# EAGLE design basic-thermometer.TH (EAGLE 7.1.0)
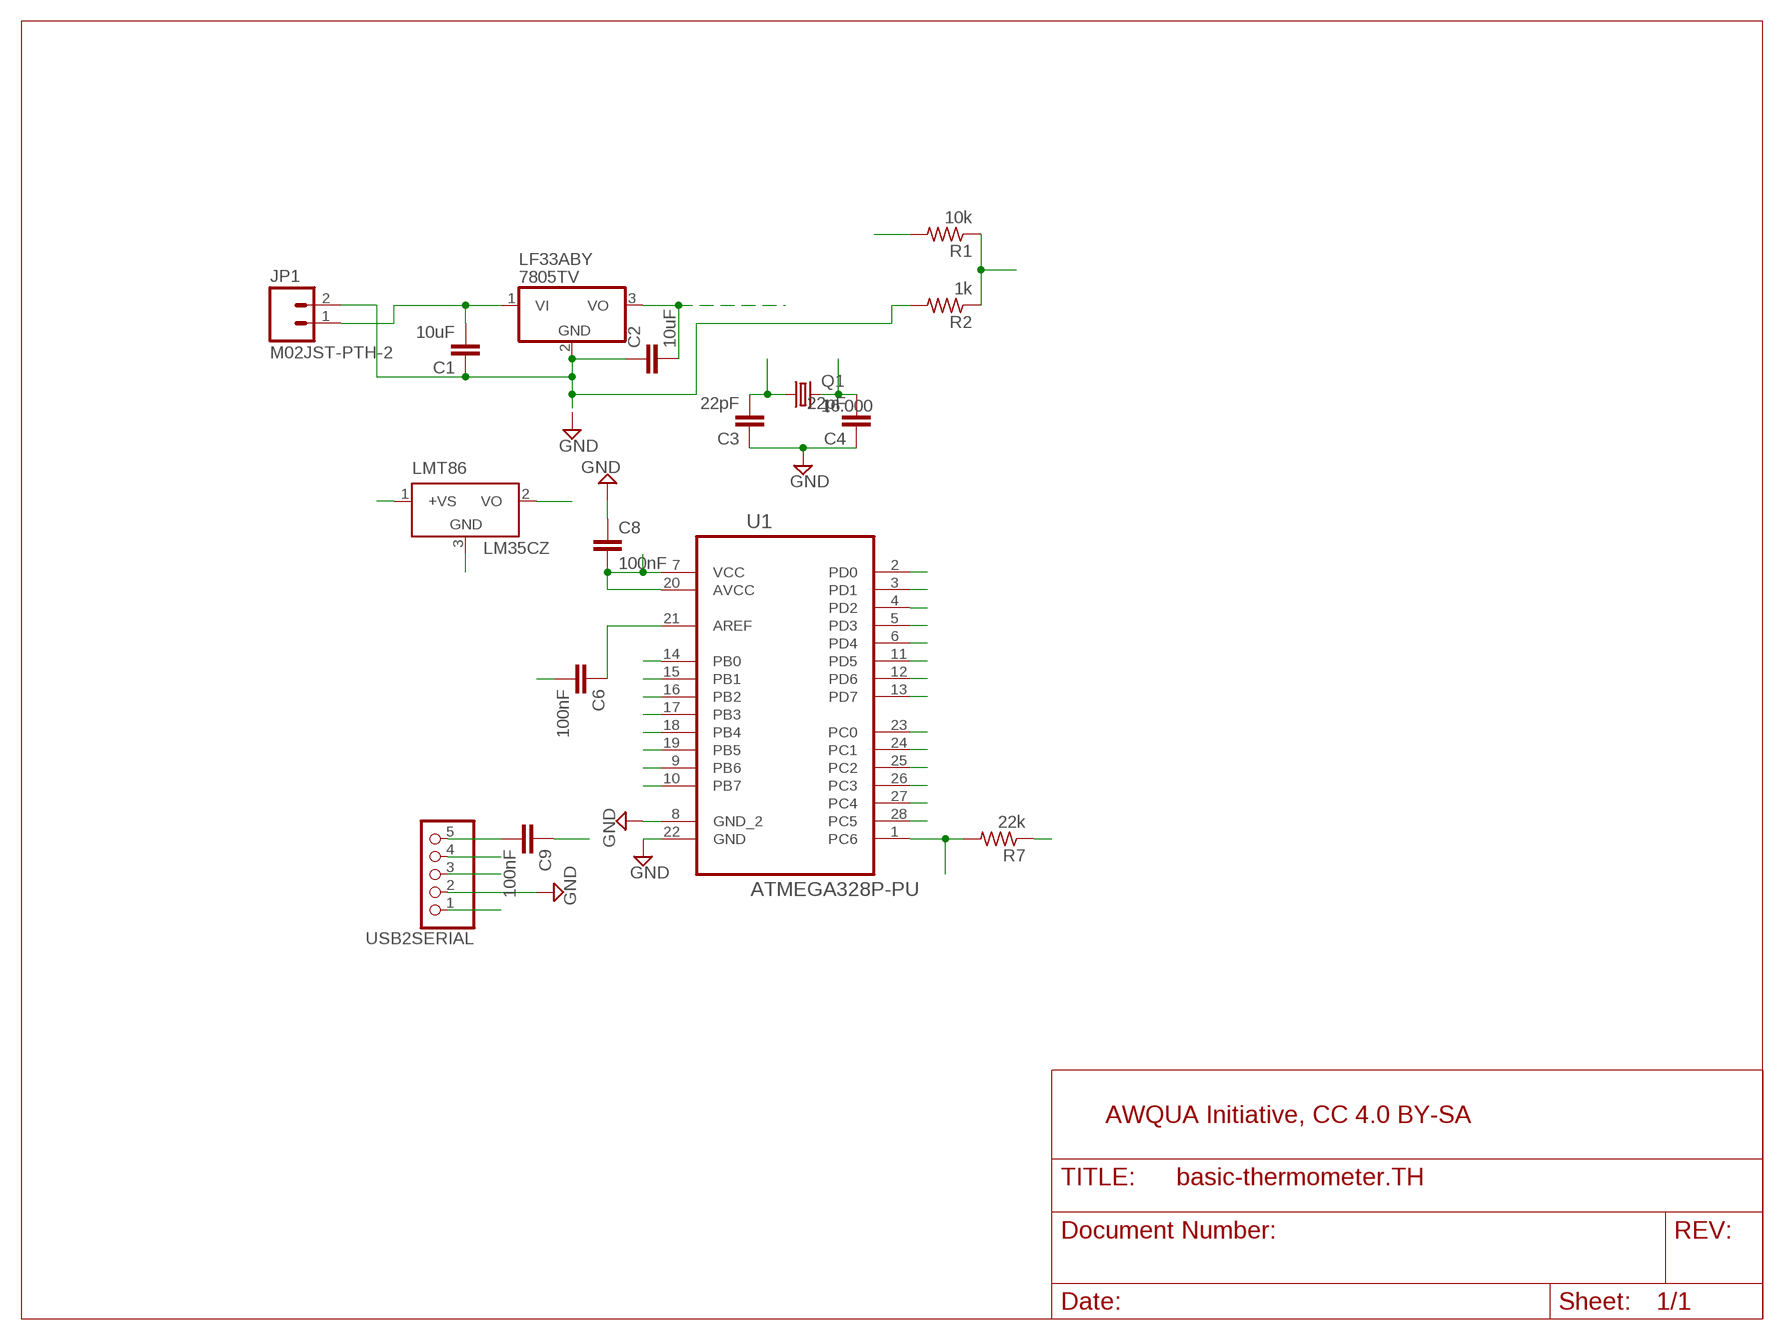
[diagram p0: schematic, sheet 1]

## Parts
C1  10uF  CAPEZ  [CAP-PTH-SMALLEZ]
C2  10uF  CAPEZ  [CAP-PTH-SMALLEZ]
C3  22pF  CAPEZ  [CAP-PTH-SMALLEZ]
C4  22pF  CAPEZ  [CAP-PTH-SMALLEZ]
C6  100nF  CAPEZ  [CAP-PTH-SMALLEZ]
C8  100nF  CAPEZ  [CAP-PTH-SMALLEZ]
C9  100nF  CAPEZ  [CAP-PTH-SMALLEZ]
JP1  M02JST-PTH-2  [JST-2-PTH]
LF33ABY  7805TV  [TO220V]
LMT86  LM35CZ  [TO92]
Q1  16.000  CRYSTALHC49S  [HC49/S]
R1  10k  R-US_0204/7  [0204/7]
R2  1k  R-US_0204/7  [0204/7]
R7  22k  R-US_0204/7  [0204/7]
U1  ATMEGA328P-PU  [DIP254P762X457-28]
USB2SERIAL  PINHD-1X5  [1X05]

## Nets
3V3: C2.2 C8.2 LF33ABY.3(VO) LMT86.1(+VS) R1.2 R7.1 U1.7(VCC) U1.20(AVCC) USB2SERIAL.1
GND: C1.1 C2.1 C3.1 C4.1 C6.2 C8.1 JP1.2 LF33ABY.2(GND) LMT86.3(GND) R2.2 U1.5(PD3) U1.8(GND_2) U1.13(PD7) U1.22(GND) USB2SERIAL.2
N$1: C1.2 JP1.1 LF33ABY.1(VI)
N$3: C6.1 U1.21(AREF)
N$6: C9.2 USB2SERIAL.5
PB0: U1.14(PB0)
PB1: U1.15(PB1)
PB2: U1.16(PB2)
PB3: U1.17(PB3)
PB4: U1.18(PB4)
PB5: U1.19(PB5)
PB6: C3.2 Q1.1 U1.9(PB6)
PB7: C4.2 Q1.2 U1.10(PB7)
PC0: LMT86.2(VO) U1.23(PC0)
PC1: U1.24(PC1)
PC2: U1.25(PC2)
PC3: U1.26(PC3)
PC4: R1.1 R2.1 U1.27(PC4)
PC5: U1.28(PC5)
PC6: C9.1 R7.2 U1.1(PC6)
PD0: U1.2(PD0) USB2SERIAL.3
PD1: U1.3(PD1) USB2SERIAL.4
PD2: U1.4(PD2)
PD4: U1.6(PD4)
PD5: U1.11(PD5)
PD6: U1.12(PD6)

## Notes on the sheet
- AWQUA Initiative, CC 4.0 BY-SA

## Library data of the parts
C1-C4 C6 C8 C9 = SparkFun-Capacitors:CAP: Capacitor Standard 0603 ceramic capacitor, and 0.1" leaded capacitor.
JP1 = SparkFun-Connectors:M02: Standard 2-pin 0.1" header. Use with - straight break away headers ( PRT-00116) - right angle break away headers (PRT-00553) - swiss pins (PRT-00743) - machine pins (PRT-00117) - female headers (PRT-00115) Molex polarized connector foot print use with: PRT-08233 with associated crimp pins and housings. 2.54_SCREWTERM for use with PRT-10571. 3.5mm Screw Terminal footprints for PRT-08084 5mm Screw Terminal footprints for use with PRT-08433
LF33ABY = linear:78*: Positive VOLTAGE REGULATOR Source: http://cache.national.com/ds/LM/LM78L05.pdf http://www.fairchildsemi.com/ds/LM/LM7805.pdf
LMT86 = lm35:LM35: Single-Supply Centigrade Temperature Sensor Vout = (10mV/°C x Temp °C) +5mmmV Source: http://www.national.com/ds/LM/LM35.pdf
Q1 = adafruit:CRYSTAL: CRYSTAL; OC_FARNELL: 1667008; OC_NEWARK: unknown
R1 R2 R7 = rcl:R-US_: RESISTOR, American symbol
U1 = Atmel_By_element14_Batch_1-00:ATMEGA328P-PU: 8-bit Microcontroller with In-System Programmable Flash; MPN: ATMEGA328P-PU; OC_FARNELL: 1715487; OC_NEWARK: 15R0268; PACKAGE: PDIP-28; SUPPLIER: Atmel
USB2SERIAL = pinhead:PINHD-1X5: PIN HEADER

## Board
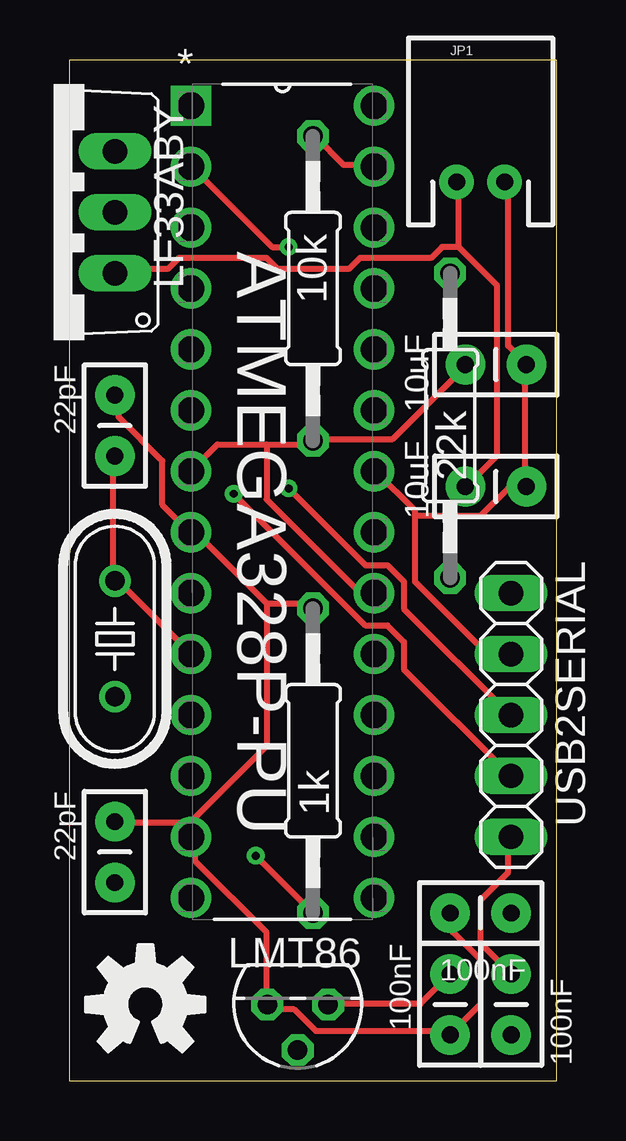
[diagram p1: board, top side]
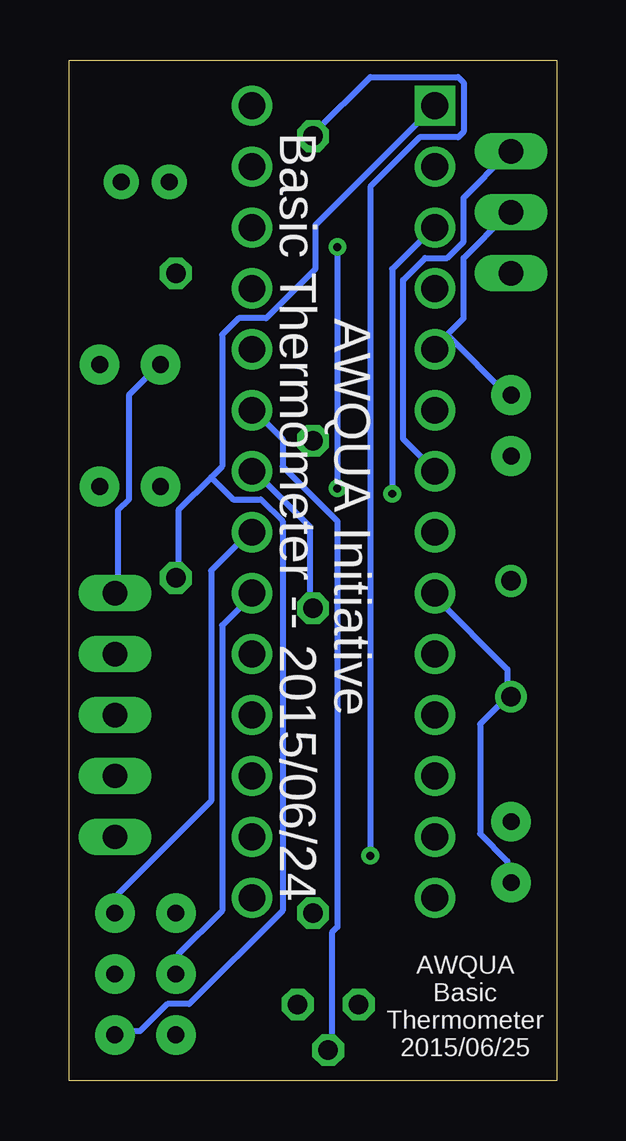
[diagram p2: board, bottom side, seen from below]

Size 20.32 x 42.55 mm. Coordinates in mm from the lower left corner, seen from the top.
Outline: 0,0 20.32,0 20.32,42.55 0,42.53 0,0
Copper layers (1*16): Top 0.035mm / dielectric 1.5mm / Bottom 0.035mm
Design rules "default": minimum track width 10mil, minimum drill 24mil, track to track 8mil, track to pad 8mil, pad to pad 8mil, via to via 8mil, smd to smd 8mil, copper to edge 40mil, drill to drill 8mil, minimum pad ring 10mil, minimum via ring 8mil, stop-mask expansion 4mil, vias tented up to drill 0mil, thermal gap 10mil

### Footprints (pad centres in the part's own frame; a part is rotated, then mirrored left to right if it is on the bottom)
CAP-PTH-SMALLEZ = drill 0.7 pad 1.651: 1 0,0; 2 2.54,0
JST-2-PTH = drill 0.7 pad 1.448: 1 -1,0; 2 1,0
TO220V = drill 1.016 long: 1 -2.54,-2.54; 2 0,-2.54; 3 2.54,-2.54
TO92 = drill 0.813 octagon: 1 -1.27,0; 2 0,1.905; 3 1.27,0
HC49/S = drill 0.813: 1 -2.413,0; 2 2.413,0
0207/12 = drill 0.813 octagon: 1 -6.35,0; 2 6.35,0
DIP254P762X457-28 = drill 1.118 square: 1 -7.62,33.02 | drill 1.118: 2 -7.62,30.48; 3 -7.62,27.94; 4 -7.62,25.4; 5 -7.62,22.86; 6 -7.62,20.32; 7 -7.62,17.78; 8 -7.62,15.24; 9 -7.62,12.7; 10 -7.62,10.16; 11 -7.62,7.62; 12 -7.62,5.08; 13 -7.62,2.54; 14 -7.62,0; 15 0,0; 16 0,2.54; 17 0,5.08; 18 0,7.62; 19 0,10.16; 20 0,12.7; 21 0,15.24; 22 0,17.78; 23 0,20.32; 24 0,22.86; 25 0,25.4; 26 0,27.94; 27 0,30.48; 28 0,33.02
1X05 = drill 1.016 long: 1 -5.08,0; 2 -2.54,0; 3 0,0; 4 2.54,0; 5 5.08,0

### Placement (x,y rotation side)
C1  19.05,24.77 180 top
C2  19.05,29.84 180 top
C3  1.91,10.79 270 top
C4  1.91,28.57 270 top
C6  18.41,6.99 180 top
C8  15.88,1.91 90 top
C9  18.41,1.91 90 top
JP1  17.14,37.47 0 top
LF33ABY  -0.64,36.2 90 top
LMT86  9.53,3.17 180 top
Q1  1.91,18.41 90 top
R1  10k  [0207/12]  10.16,33.02 270 top
R2  1k  [0207/12]  10.16,13.34 90 top
R7  22k  [0207/12]  15.88,27.3 270 top
U1  12.7,7.62 0 top
U$1  [OSHW-LOGO-M]  3.17,3.17 0 top
USB2SERIAL  18.41,15.24 270 top

### Tracks (layer width: path | path; a pad name or v marks a point on that pad's centre or on a via)
3V3
  Top 0.254: R7.1 16,33.6 16,30.4 16.46,29.95 C2.2 16.46,29.72 13.49,26.75 10.29,26.75 R1.2 10.06,26.52 8.23,26.52 | C8.2 14.63,3.2 10.97,3.2 LMT86.1 | 8.23,26.52 6.17,26.52 5.26,25.6 U1.7 | 8.23,26.52 8.23,24.23 12.12,20.34 12.57,20.34 U1.20
  Bottom 0.254: USB2SERIAL.1 18.29,20.34 18.29,23.77 17.83,24.23 17.83,28.57 16.69,29.72 C2.2 | LF33ABY.3 2.06,38.63 3.89,36.8 3.89,34.98 4.57,34.29 5.49,34.29 6.4,33.38 6.4,26.75 5.26,25.6 U1.7 | C8.2 15.77,4.57 15.77,5.26 13.95,7.09 13.95,18.97 12.8,20.12 U1.20
GND
  Top 0.254: 4.8,10.52 5.03,10.29 U1.13 | 4.8,10.52 4.57,10.74 2.06,10.74 C3.1 | C6.2 16,6.86 16,6.17 17.14,5.03 17.14,3.2 16,2.06 C8.1 15.77,2.06 10.29,2.06 9.37,2.97 8.46,2.97 LMT86.3 8.23,3.2 8.23,6.17 5.26,9.14 5.26,10.06 U1.13 | JP1.2 18.29,37.26 18.29,30.63 18.97,29.95 C2.1 18.97,29.72 18.97,24.92 C1.1 18.97,24.69 18.29,24.69 17.14,23.55 14.4,23.55 | 8.23,19.89 10.06,19.89 R2.2 | 8.23,19.89 5.26,22.86 U1.8 5.03,22.86 3.89,24 3.89,25.83 2.06,27.66 2.06,28.57 C4.1 | 14.4,23.55 14.4,23.77 12.8,25.38 U1.22 | 14.4,23.55 14.4,20.8 17.37,17.83 18.29,17.83 USB2SERIAL.2 | 4.8,10.52 8.23,13.95 8.23,19.89 | 4.8,10.52 U1.13
  Bottom 0.254: 4.57,31.09 5.03,30.63 U1.5 4.57,31.09 | 4.57,31.09 3.89,31.77 3.89,34.29 2.06,36.12 LF33ABY.2 | 4.57,31.09 2.06,28.57 C4.1 | R2.2 10.29,19.89 10.29,23.09 12.57,25.38 U1.22
N$1
  Top 0.254: 16.23,34.75 16.23,37.26 JP1.1 | 16.23,34.75 17.83,33.15 17.83,26.06 16.69,24.92 C1.2 | 16.23,34.75 15.54,34.75 15.09,34.29 12.12,34.29 11.66,33.83 8.69,33.83 8.23,34.29 4.57,34.29 4.12,33.83 2.06,33.83 LF33ABY.1
N$3
  Bottom 0.254: C6.1 18.29,7.09 18.29,7.77 14.4,11.66 14.4,21.26 12.8,22.86 U1.21
N$6
  Top 0.254: C9.2 17.14,5.71 17.14,7.54 18.29,8.69 18.29,10.06 USB2SERIAL.5
PB6
  Bottom 0.254: 2.06,16 2.06,17.14 5.03,20.12 U1.9 | 2.06,16 3.2,14.86 3.2,10.29 2.06,9.14 2.06,8.46 C3.2 | 2.06,16 Q1.1
PB7
  Top 0.254: U1.10 2.06,20.8 Q1.2 1.83,21.03 1.83,25.83 C4.2
PC0
  Bottom 0.254: LMT86.2 9.37,1.37 9.37,6.17 9.14,6.4 9.14,23.32 11.43,25.6 11.43,26.75 12.57,27.89 U1.23
PC4  (via drill 0.33)
  Top 0.254: v7.77,9.37 R2.1 | U1.27 12.57,38.18 11.43,38.18 10.29,39.32 R1.1
  Bottom 0.254: v7.77,9.37 7.77,37.26 5.71,39.32 4.12,39.32 3.89,39.55 3.89,41.6 4.12,41.83 7.77,41.83 10.06,39.55 R1.1
PC6
  Bottom 0.254: 14.4,25.15 13.95,25.6 13.95,31.09 13.26,31.77 12.12,31.77 10.06,33.83 10.06,35.66 U1.1 | 14.4,25.15 15.77,23.77 15.77,21.03 R7.2 | 14.4,25.15 13.49,24.23 12.34,24.23 11.43,23.32 11.43,7.09 15.32,3.2 16.23,3.2 17.37,2.06 18.29,2.06 C9.1
PD0  (via drill 0.33)
  Top 0.254: v9.14,24.69 12.34,21.49 13.26,21.49 13.95,20.8 13.95,19.66 18.29,15.32 USB2SERIAL.3 | v9.14,34.75 8.46,34.75 5.26,37.95 U1.2
  Bottom 0.254: v9.14,34.75 v9.14,24.69
PD1  (via drill 0.33)
  Top 0.254: v6.86,24.46 12.34,18.97 13.26,18.97 13.95,18.29 13.95,17.14 18.29,12.8 USB2SERIAL.4
  Bottom 0.254: v6.86,24.46 6.86,33.83 5.26,35.43 U1.3

### Text on the board
bNames: AWQUA Initiative / Basic Thermometer -- 2015/06/24 | AWQUA / Basic / Thermometer / 2015/06/25